# EAGLE schematic apu_mega_shield (EAGLE 6.5.0)
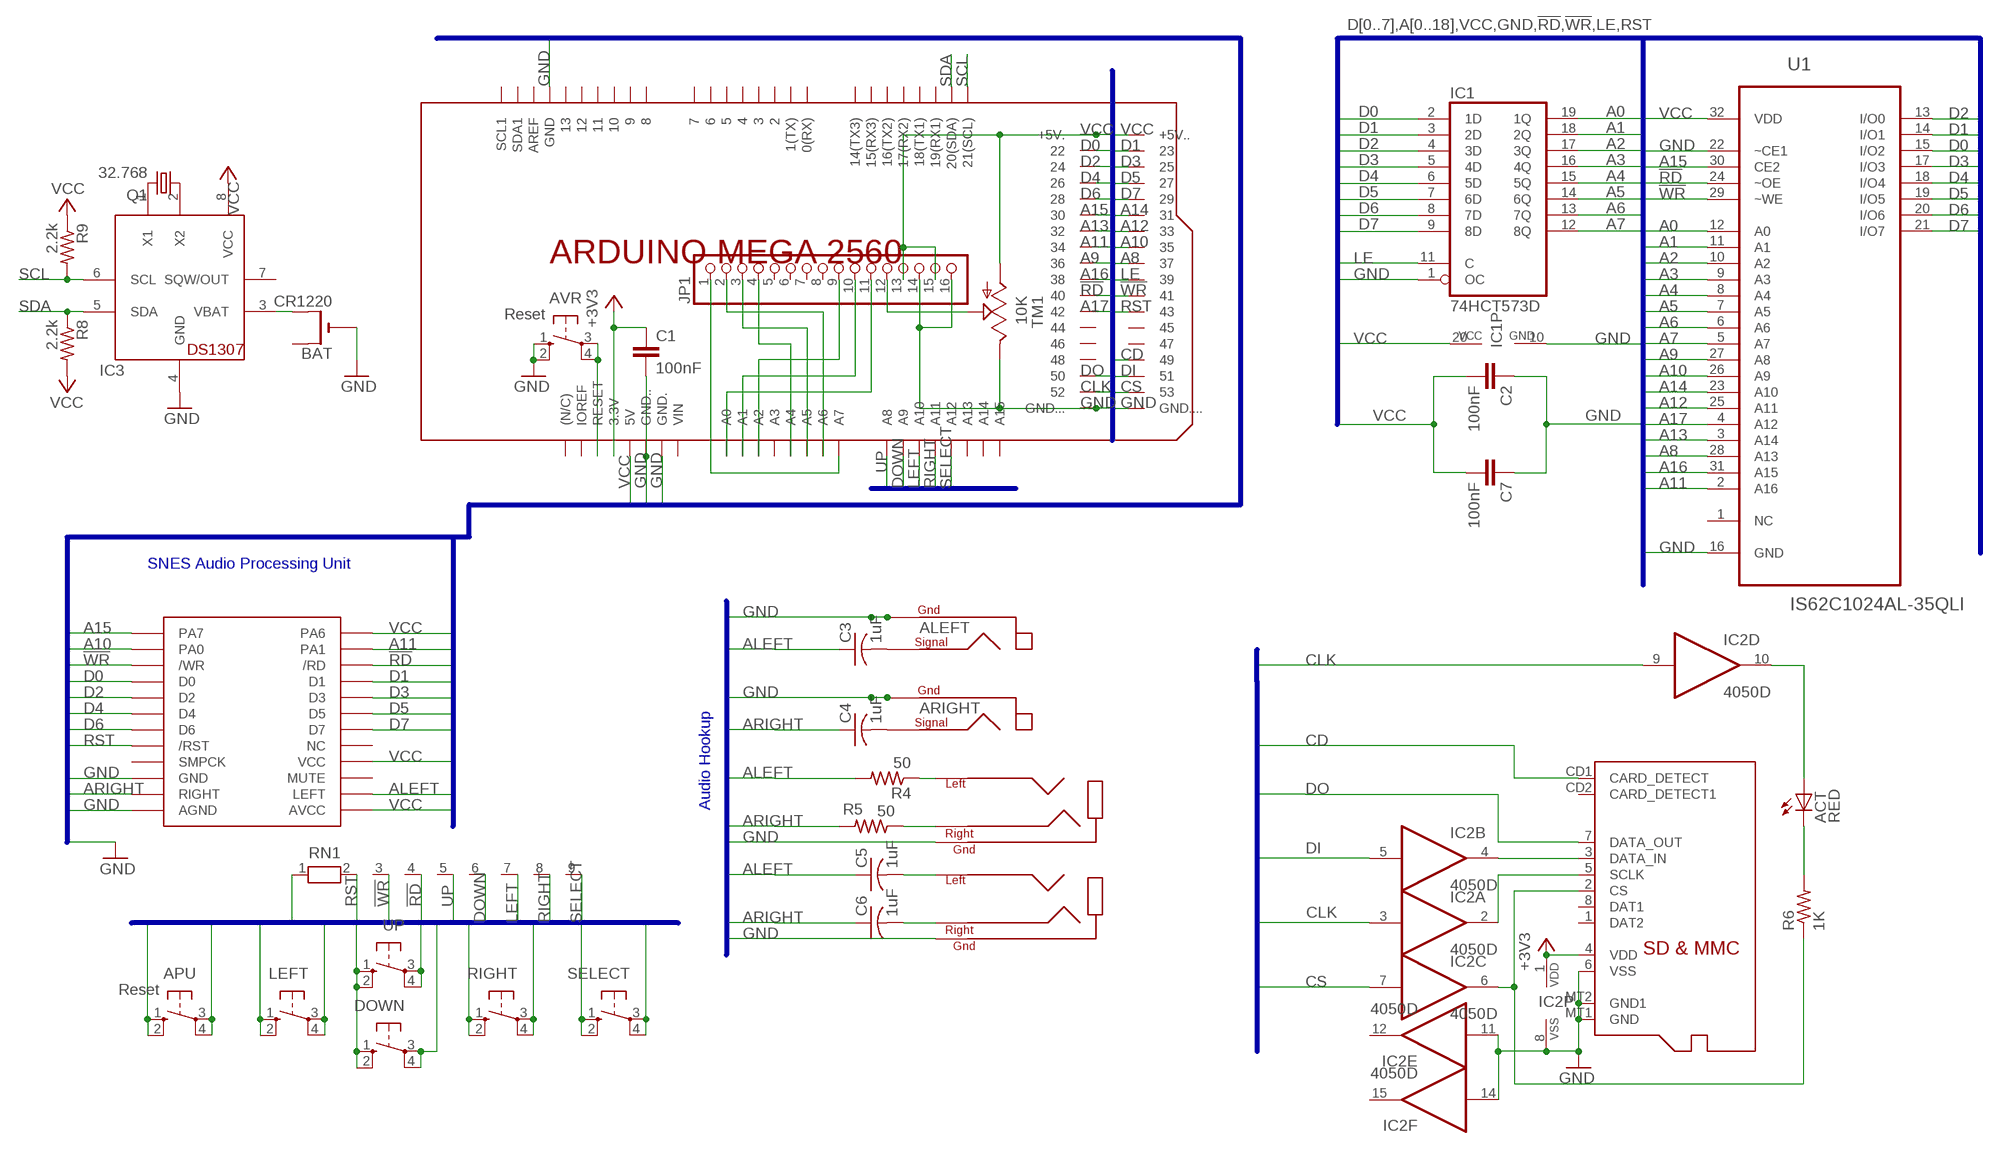
[diagram p0: schematic, sheet 1]

## Parts
ACT  RED  LEDCHIP-LED0805  [CHIP-LED0805]
APU  Reset  10-XX  [B3F-10XX]
AVR  Reset  10-XX  [B3F-10XX]
BAT  CR1220  CR1220THM  [CR1220-THM]
C1  100nF  C-EUC0603  [C0603]
C2  100nF  C-EUC0603  [C0603]
C3  1uF  C-US025-025X050  [C025-025X050]
C4  1uF  C-US025-025X050  [C025-025X050]
C5  1uF  C-US025-025X050  [C025-025X050]
C6  1uF  C-US025-025X050  [C025-025X050]
C7  100nF  C-EUC0603  [C0603]
DOWN  10-XX  [B3F-10XX]
IC1  74HCT573D  [SO20W]
IC2  4050D  [SO16]
IC3  DS1307  [DIL08]
JP1  PINHD-1X16  [1X16]
LEFT  10-XX  [B3F-10XX]
Q1  32.768  CRYTALTC38H  [TC38H]
R4  50  R-US_0207/10  [0207/10]
R5  50  R-US_0207/10  [0207/10]
R6  1K  R-US_R0805  [R0805]
R8  2.2k  R-US_0207/10  [0207/10]
R9  2.2k  R-US_0207/10  [0207/10]
RIGHT  10-XX  [B3F-10XX]
RN1  RN08  [RN-9]
SELECT  10-XX  [B3F-10XX]
TM1  10K  TRIM_US-CA6H  [CA6H]
U1  IS62C1024AL-35QLI  [SOIC127P1412X305-32N]
U$1  APU  [APU]
U$2  HEADPHONE  [SJ1-3533N]
U$3  HEADPHONE  [SJ1-3533N]
U$4  RCA  [RCJ-01X]
U$5  RCA  [RCJ-01X]
U$6  ARDUINO_MEGA_2560_LITENO_LABELS  [ARDUINO_MEGA2560_LITE_NO_LABELS]
UP  10-XX  [B3F-10XX]
X1  MICROSD  [MICROSD]

## Nets
!RD: RN1.4 U1.24(~OE) U$1.P$6(/RD) U$6.40
!WR: RN1.3 U1.29(~WE) U$1.P$5(/WR) U$6.41
+3V3 [supply]: C1.1 IC2.1(P:VDD) U$6.3.3V X1.4(VDD)
A0: IC1.19(1Q) U1.12(A0)
A1: IC1.18(2Q) U1.11(A1)
A2: IC1.17(3Q) U1.10(A2)
A3: IC1.16(4Q) U1.9(A3)
A4: IC1.15(5Q) U1.8(A4)
A5: IC1.14(6Q) U1.7(A5)
A6: IC1.13(7Q) U1.6(A6)
A7: IC1.12(8Q) U1.5(A7)
A8: U1.28(A13) U$6.37
A9: U1.27(A8) U$6.36
A10: U1.26(A9) U$1.P$3(PA0) U$6.35
A11: U1.2(A16) U$1.P$4(PA1) U$6.34
A12: U1.25(A11) U$6.33
A13: U1.3(A14) U$6.32
A14: U1.23(A10) U$6.31
A15: U1.30(CE2) U$1.P$1(PA7) U$6.30
A16: U1.31(A15) U$6.38
A17: U1.4(A12) U$6.42
ALEFT [audio]: C3.1 C5.1 R4.2 U$1.P$22(LEFT)
ARIGHT [audio]: C4.1 C6.1 R5.2 U$1.P$21(RIGHT)
CD: U$6.49 X1.CD1(CARD_DETECT)
CLK: IC2.3(A:I) IC2.9(D:I) U$6.52
CS: IC2.7(C:I) U$6.53
D0: IC1.2(1D) U1.15(I/O2) U$1.P$7(D0) U$6.22
D1: IC1.3(2D) U1.14(I/O1) U$1.P$8(D1) U$6.23
D2: IC1.4(3D) U1.13(I/O0) U$1.P$9(D2) U$6.24
D3: IC1.5(4D) U1.17(I/O3) U$1.P$10(D3) U$6.25
D4: IC1.6(5D) U1.18(I/O4) U$1.P$11(D4) U$6.26
D5: IC1.7(6D) U1.19(I/O5) U$1.P$12(D5) U$6.27
D6: IC1.8(7D) U1.20(I/O6) U$1.P$13(D6) U$6.28
D7: IC1.9(8D) U1.21(I/O7) U$1.P$14(D7) U$6.29
DI: IC2.5(B:I) U$6.51
DO: U$6.50 X1.7(DATA_OUT)
DOWN [supply]: DOWN.3(P) DOWN.4(P1) RN1.6 U$6.A9
GND [supply]: APU.1(S) APU.2(S1) AVR.1(S) AVR.2(S1) BAT.- C1.2 C2.1 C7.1 DOWN.1(S) DOWN.2(S1) IC1.1(OC) IC1.10(GND) IC2.8(P:VSS) IC2.11(E:I) IC2.14(F:I) IC3.4(GND) JP1.14 JP1.16 LEFT.1(S) LEFT.2(S1) RIGHT.1(S) RIGHT.2(S1) SELECT.1(S) SELECT.2(S1) TM1.E U1.16(GND) U1.22(~CE1) U$1.P$19(GND) U$1.P$23(AGND) U$2.GND U$3.GND U$4.PGND1 U$4.PGND2(PGND1) U$4.PGND3(PGND1) U$5.PGND1 U$5.PGND2(PGND1) U$5.PGND3(PGND1) U$6.GND U$6.GND. U$6.GND.. U$6.GND... U$6.GND.... UP.1(S) UP.2(S1) X1.6(VSS) X1.MT1(GND) X1.MT2(GND1)
LE: IC1.11(C) U$6.39
LEFT [supply]: LEFT.3(P) LEFT.4(P1) RN1.7 U$6.A10
N$1: AVR.3(P) AVR.4(P1) U$6.RESET
N$2 [audio]: C3.2 U$4.PSIG
N$3 [audio]: C4.2 U$5.PSIG
N$4 [audio]: C5.2 U$3.LEFT
N$5: ACT.A IC2.10(D:O)
N$6: IC2.2(A:O) X1.5(SCLK)
N$7: IC2.6(C:O) R6.1 X1.2(CS)
N$8 [audio]: C6.2 U$3.RIGHT
N$9 [audio]: R4.1 U$2.LEFT
N$10 [audio]: R5.1 U$2.RIGHT
N$11: ACT.C R6.2
N$12: IC2.4(B:O) X1.3(DATA_IN)
N$13 [supply]: JP1.12 TM1.S
N$14 [supply]: JP1.11 U$6.A0
N$15 [supply]: JP1.10 U$6.A1
N$16 [supply]: JP1.9 U$6.A2
N$17 [supply]: JP1.4 U$6.A4
N$18 [supply]: JP1.3 U$6.A5
N$19 [supply]: JP1.2 U$6.A6
N$20 [supply]: JP1.1 U$6.A7
N$21: IC3.1(X1) Q1.2
N$22: IC3.2(X2) Q1.1
N$39: BAT.+2(+1) IC3.3(VBAT)
RIGHT [supply]: RIGHT.3(P) RIGHT.4(P1) RN1.8 U$6.A11
RST: APU.3(P) APU.4(P1) RN1.2 U$1.P$15(/RST) U$6.43
SCL: IC3.6(SCL) R9.2 U$6.21(21(SCL))
SDA: IC3.5(SDA) R8.1 U$6.20(20(SDA))
SELECT [supply]: RN1.9 SELECT.3(P) SELECT.4(P1) U$6.A12
UP [supply]: RN1.5 U$6.A8 UP.3(P) UP.4(P1)
VCC [supply]: C2.2 C7.2 IC1.20(VCC) IC3.8(VCC) JP1.13 JP1.15 R8.2 R9.1 RN1.1 TM1.A U1.32(VDD) U$1.P$2(PA6) U$1.P$18(VCC) U$1.P$24(AVCC) U$6.5V U$6.5V.(+5V.) U$6.5V..(+5V..)
Unconnected: BAT.+1(+) IC2.12(E:O) IC2.15(F:O) IC3.7(SQW/OUT) JP1.5 JP1.6 JP1.7 JP1.8 U1.1(NC) U$1.P$16(NC) U$1.P$17(SMPCK) U$1.P$20(MUTE) U$6.0(0(RX)) U$6.1(1(TX)) U$6.2 U$6.3 U$6.4 U$6.5 U$6.6 U$6.7 U$6.8 U$6.9 U$6.10 U$6.11 U$6.12 U$6.13 U$6.14(14(TX3)) U$6.15(15(RX3)) U$6.16(16(TX2)) U$6.17(17(RX2)) U$6.18(18(TX1)) U$6.19(19(RX1)) U$6.44 U$6.45 U$6.46 U$6.47 U$6.48 U$6.A3 U$6.A13 U$6.A14 U$6.A15 U$6.AREF U$6.I/OREF(IOREF) U$6.N/C((N/C)) U$6.SCL1 U$6.SDA1 U$6.VIN X1.1(DAT2) X1.8(DAT1) X1.CD2(CARD_DETECT1)

## Buses
D[0..7],A[0..18],VCC,GND,!RD,!WR,LE,RST
D[0..7],A[0..18],!WR,!RD,RST,ALEFT,ARIGHT,VCC,GND
D[0..7],A[0..18],VCC,GND,!RD,!WR,LE,CD,DO,DI,CLK,CS
D[0..7],A[0..18],VCC,GND,!RD,!WR,LE,CD,DO,DI,CLK,CS,RST
D[0..7],A[0..1],WR,RD,RST,ALEFT,ARIGHT,GND
RST,!WR,!RD,UP,DOWN,LEFT,RIGHT,SELECT,VCC,GND

## Notes on the sheet
- SNES Audio Processing Unit
- Audio Hookup

## Library data of the parts
ACT = adafruit:LED: LED OSRAM: - CHIPLED LG R971, LG N971, LY N971, LG Q971, LY Q971, LO R971, LY R971 LH N974, LH R974 LS Q976, LO Q976, LY Q976 LO Q996 - Hyper CHIPLED LW Q18S LB Q993, LB Q99A, LB R99A - SideLED LS A670, LO A670, LY A670, LG A670, LP A670 LB A673, LV A673, LT A673, LW A673 LH A674 LY A675 LS A676, LA A676, LO A676, LY A676, LW A676 LS A679, LY A679, LG A679 - Hyper Micro SIDELED® LS Y876, LA Y876, LO Y876, LY Y876 LT Y87S - SmartLED LW L88C, LW L88S LB L89C, LB L89S, LG L890 LS L89K, LO L89K, LY L89K LS L896, LA L896, LO L896, LY L896 - TOPLED LS T670, LO T670, LY T670, LG T670, LP T670 LSG T670, LSP T670, LSY T670, LOP T670, LYG T670 LG T671, LOG T671, LSG T671 LB T673, LV T673, LT T673, LW T673 LH T674 LS T676, LA T676, LO T676, LY T676, LB T676, LH T676, LSB T676, LW T676 LB T67C, LV T67C, LT T67C, LS T67K, LO T67K, LY T67K, LW E67C LS E67B, LA E67B, LO E67B, LY E67B, LB E67C, LV E67C, LT E67C LW T67C LS T679, LY T679, LG T679 LS T770, LO T770, LY T770, LG T770, LP T770 LB T773, LV T773, LT T773, LW T773 LH T774 LS E675, LA E675, LY E675, LS T675 LS T776, LA T776, LO T776, LY T776, LB T776 LHGB T686 LT T68C, LB T68C - Hyper Mini TOPLED® LB M676 - Mini TOPLED Santana® LG M470 LS M47K, LO M47K, LY M47K Source: http://www.osram.convergy.de/
APU AVR DOWN LEFT RIGHT SELECT UP = switch-omron:10-XX: OMRON SWITCH
BAT = adafruit:CR1220: CR1216/CR1220/CR1225 12mm 3V lithium coin cell Great for battery packup. Both SMT and THM holders. Note the THM package has the ground pads on both sides of the PCB so that the masks are the same - this reduces the cost
C1 C2 C7 = resistor:C-EU: CAPACITOR, European symbol
C3-C6 = rcl-ez:C-US: CAPACITOR, American symbol
IC1 = 74xx-eu:74*573: 8-bit D latch BUS DRIVER
IC2 = 40xx:4050: Hex non-inverting BUFFER
IC3 = adafruit:DS1307: DS1307 Real time clock (RTC) with battery backup ability. Talk to it via i2c
JP1 = pinhead:PINHD-1X16: PIN HEADER
Q1 = crystal:CRYTAL: CRYSTAL
R4 R5 = rcl:R-US_: RESISTOR, American symbol
R6 R8 R9 = adafruit:R-US_: RESISTOR, American symbol
RN1 = resistor-net:RN08: RESISTOR NETWORK; OC_FARNELL: unknown; OC_NEWARK: unknown
TM1 = pot:TRIM_US-: POTENTIOMETER
U1 = ISSI_By_element14_Batch_1:IS62C1024AL-35QLI: STATIC RAM; MPN: IS62C1024AL-35QLI; OC_FARNELL: 1869973; OC_NEWARK: 43M5399; PACKAGE: SOIC-32; SUPPLIER: INTEGRATED SILICON SOLUTION (ISSI)
U$1 = caitsith2:APU
U$2 U$3 = caitsith2:HEADPHONE
U$4 U$5 = caitsith2:RCA
U$6 = E14_Arduino_revB:ARDUINO_MEGA_2560_LITE
X1 = adafruit:MICROSD: Micro-SD / Transflash card holder with SPI pinout For the 3M # 2908-05WB-MG and/or 4UCON #19656 push-push type

## Net classes
0 default: width 0.152 mm, clearance 0.152 mm
1 supply: width 0.305 mm, clearance 0.152 mm
2 audio: width 0.305 mm, clearance 0.152 mm